# EAGLE schematic v1 (EAGLE 6.1)
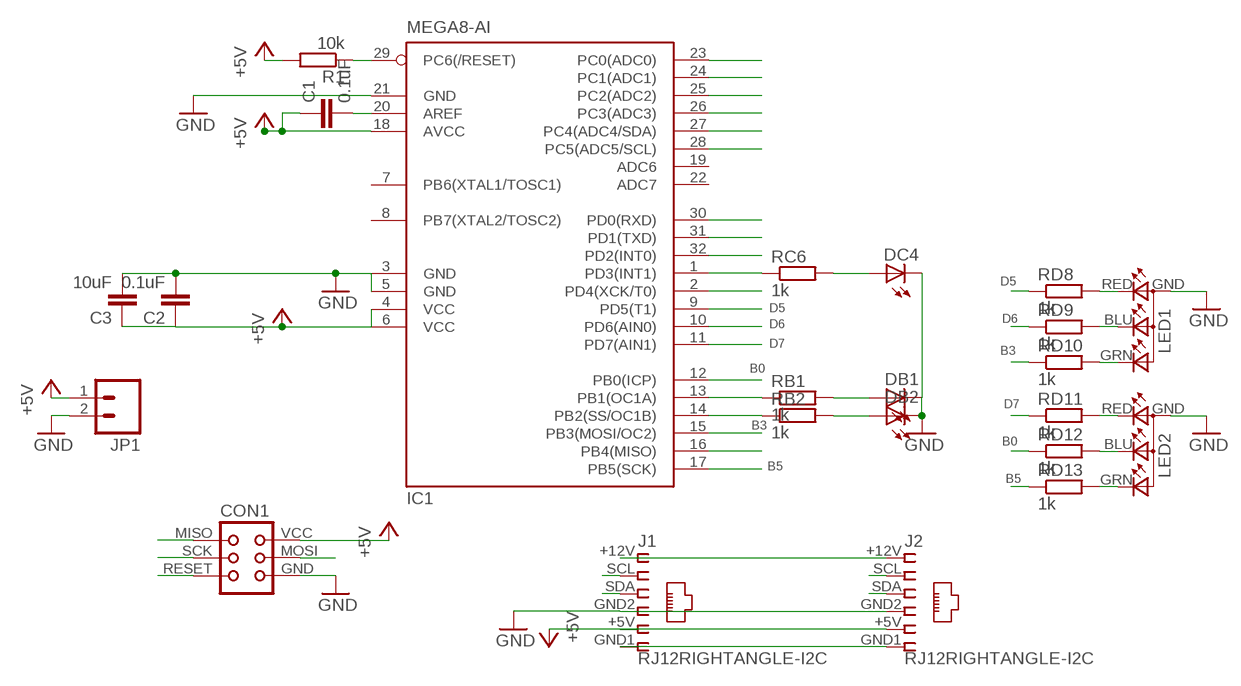
[diagram p0: schematic, sheet 1]

## Parts
C1  0.1uF  C-EUC1206  [C1206]
C2  0.1uF  C-EUC1206  [C1206]
C3  10uF  C-EUC1206  [C1206]
CON1  TINYISP  [TINYISP]
DB1  LED3MM  [LED3MM]
DB2  LED3MM  [LED3MM]
DC4  LED3MM  [LED3MM]
IC1  MEGA8-AI  [TQFP32-08]
J1  RJ12RIGHTANGLE-I2C  [RJ12-RIGHTANGLE-I2C]
J2  RJ12RIGHTANGLE-I2C  [RJ12-RIGHTANGLE-I2C]
JP1  M023.5MM  [SCREWTERMINAL-3.5MM-2]
LED1  TOPLED-3  [LED-TRICOLOR-THROUGHHOLE]
LED2  TOPLED-3  [LED-TRICOLOR-THROUGHHOLE]
R1  10k  R-EU_M1206  [M1206]
RB1  1k  R-EU_M1206  [M1206]
RB2  1k  R-EU_M1206  [M1206]
RC6  1k  R-EU_M1206  [M1206]
RD8  1k  R-EU_M1206  [M1206]
RD9  1k  R-EU_M1206  [M1206]
RD10  1k  R-EU_M1206  [M1206]
RD11  1k  R-EU_M1206  [M1206]
RD12  1k  R-EU_M1206  [M1206]
RD13  1k  R-EU_M1206  [M1206]

## Nets
+5V [power]: C1.1 C2.1 C3.1 CON1.VCC IC1.4(VCC) IC1.6(VCC) IC1.18(AVCC) J1.+5V J2.+5V JP1.1 R1.2
B0: IC1.12(PB0(ICP)) RD12.1
B3: IC1.15(PB3(MOSI/OC2)) RD10.1
B5: IC1.17(PB5(SCK)) RD13.1
D5: IC1.9(PD5(T1)) RD8.1
D6: IC1.10(PD6(AIN0)) RD9.1
D7: IC1.11(PD7(AIN1)) RD11.1
GND [power]: C2.2 C3.2 CON1.GND DB1.K(C) DB2.K(C) DC4.K(C) IC1.3(GND) IC1.5(GND) IC1.21(GND) J1.GND2 J2.GND2 JP1.2 LED1.GND(A2) LED2.GND(A2)
MISO: CON1.MISO IC1.16(PB4(MISO))
MOSI: CON1.MOSI
N$1: LED1.RED(CRED) RD8.2
N$2: IC1.24(PC1(ADC1))
N$3: IC1.23(PC0(ADC0))
N$4: C1.2 IC1.20(AREF)
N$5: IC1.26(PC3(ADC3))
N$6: IC1.25(PC2(ADC2))
N$7: LED1.BLU(CBLUE) RD9.2
N$8: LED1.GRN(CGREEN) RD10.2
N$9: IC1.30(PD0(RXD))
N$10: IC1.31(PD1(TXD))
N$11: IC1.1(PD3(INT1)) RC6.1
N$12: IC1.32(PD2(INT0))
N$13: J1.+12V J2.+12V
N$14: IC1.2(PD4(XCK/T0))
N$17: J1.GND1 J2.GND1
N$18: IC1.13(PB1(OC1A)) RB1.1
N$19: IC1.14(PB2(SS/OC1B)) RB2.1
N$20: LED2.RED(CRED) RD11.2
N$21: LED2.BLU(CBLUE) RD12.2
N$22: LED2.GRN(CGREEN) RD13.2
N$23: DC4.A RC6.2
N$40: DB1.A RB1.2
N$41: DB2.A RB2.2
RESET: CON1.RESET IC1.29(PC6(/RESET)) R1.1
SCK: CON1.SCK
SCL: IC1.28(PC5(ADC5/SCL)) J1.SCL J2.SCL
SDA: IC1.27(PC4(ADC4/SDA)) J1.SDA J2.SDA
Unconnected: IC1.7(PB6(XTAL1/TOSC1)) IC1.8(PB7(XTAL2/TOSC2)) IC1.19(ADC6) IC1.22(ADC7)

## Library data of the parts
C1-C3 = resistor:C-EU: CAPACITOR, European symbol
CON1 = lpatiny:TINYISP: CONNECTOR; OC_FARNELL: unknown; OC_NEWARK: unknown
DB1 DB2 DC4 = led:LED: LED OSRAM: - CHIPLED LG R971, LG N971, LY N971, LG Q971, LY Q971, LO R971, LY R971 LH N974, LH R974 LS Q976, LO Q976, LY Q976 LO Q996 - Hyper CHIPLED LW Q18S LB Q993, LB Q99A, LB R99A - SideLED LS A670, LO A670, LY A670, LG A670, LP A670 LB A673, LV A673, LT A673, LW A673 LH A674 LY A675 LS A676, LA A676, LO A676, LY A676, LW A676 LS A679, LY A679, LG A679 - Hyper Micro SIDELED® LS Y876, LA Y876, LO Y876, LY Y876 LT Y87S - SmartLED LW L88C, LW L88S LB L89C, LB L89S, LG L890 LS L89K, LO L89K, LY L89K LS L896, LA L896, LO L896, LY L896 - TOPLED LS T670, LO T670, LY T670, LG T670, LP T670 LSG T670, LSP T670, LSY T670, LOP T670, LYG T670 LG T671, LOG T671, LSG T671 LB T673, LV T673, LT T673, LW T673 LH T674 LS T676, LA T676, LO T676, LY T676, LB T676, LH T676, LSB T676, LW T676 LB T67C, LV T67C, LT T67C, LS T67K, LO T67K, LY T67K, LW E67C LS E67B, LA E67B, LO E67B, LY E67B, LB E67C, LV E67C, LT E67C LW T67C LS T679, LY T679, LG T679 LS T770, LO T770, LY T770, LG T770, LP T770 LB T773, LV T773, LT T773, LW T773 LH T774 LS E675, LA E675, LY E675, LS T675 LS T776, LA T776, LO T776, LY T776, LB T776 LHGB T686 LT T68C, LB T68C - Hyper Mini TOPLED® LB M676 - Mini TOPLED Santana® LG M470 LS M47K, LO M47K, LY M47K Source: http://www.osram.convergy.de LUXEON: - LUMILED® LXK2-PW12-R00, LXK2-PW12-S00, LXK2-PW14-U00, LXK2-PW14-V00 LXK2-PM12-R00, LXK2-PM12-S00, LXK2-PM14-U00 LXK2-PE12-Q00, LXK2-PE12-R00, LXK2-PE12-S00, LXK2-PE14-T00, LXK2-PE14-U00 LXK2-PB12-K00, LXK2-PB12-L00, LXK2-PB12-M00, LXK2-PB14-N00, LXK2-PB14-P00, LXK2-PB14-Q00 LXK2-PR12-L00, LXK2-PR12-M00, LXK2-PR14-Q00, LXK2-PR14-R00 LXK2-PD12-Q00, LXK2-PD12-R00, LXK2-PD12-S00 LXK2-PH12-R00, LXK2-PH12-S00 LXK2-PL12-P00, LXK2-PL12-Q00, LXK2-PL12-R00 Source: www.luxeon.com KINGBRIGHT: KA-3528ASYC Source: www.kingbright.com
IC1 = atmel:MEGA8: MICROCONTROLLER 8 Kbytes FLASH, 1 kbytes SRAM, 512 bytes EEPROM, USART, 6-channel 10 bit ADC, 2-channel 8 bit ADC Pin compatible with Atmega48, ATMega88, ATMega168 Source: avr.lbr; MPN: ATMEGA8-16AU; OC_FARNELL: 9171371; OC_NEWARK: 73M8863
J1 J2 = lpatiny:RJ12: CORCOM Modular RJ Jacks No Shield Source: www.tycoelectronics.com .. ENG_DS_1654001_1099_RJ_L_0507.pdf
JP1 = SparkFun:M02: Header 2 Standard 2-pin 0.1" header. Use with straight break away headers (SKU : PRT-00116), right angle break away headers (PRT-00553), swiss pins (PRT-00743), machine pins (PRT-00117), and female headers (PRT-00115). Molex polarized connector foot print use with SKU : PRT-08233 with associated crimp pins and housings.
LED1 LED2 = lpatiny:TOPLED-3: OSRAM - Hyper Multi TOPLED® (RGB) LB E673, LV E673, LT E673 - Power TOPLED® Enhanced optical Power LED (HOP2000) LS E67B, LA E67B, LO E67B, LY E67B - Hyper Multi TOPLED® Enhanced optical Power LED (HOP2000 / ATON®) LATB T66B - Hyper Multi TOPLED® Hyper-Bright LED LATB T686 Source: http://www.osram.convergy.de/
R1 RB1 RB2 RC6 RD8-RD13 = resistor:R-EU_: RESISTOR, European symbol

## Net classes
1 power: width 0.406 mm